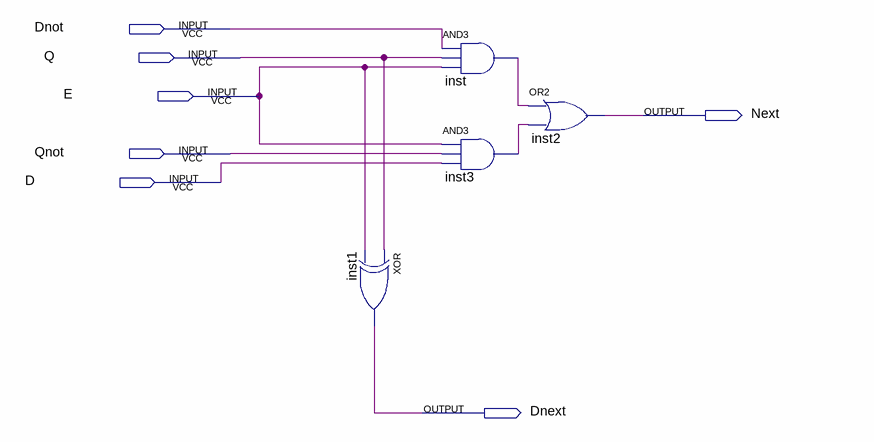
[diagram p0: schematic sheet]
// Quartus schematic block1.bdf as structural Verilog: 4 symbols, 7 pins
module block1 (
  input  Dnot,
  input  Q,
  input  E,
  input  Qnot,
  input  D,
  output Next,
  output Dnext
);

  wire inst3_out, inst_out;

  xor inst1 (Dnext, Q, E);
  and inst (inst_out, Dnot, Q, E);
  and inst3 (inst3_out, E, Qnot, D);
  or inst2 (Next, inst_out, inst3_out);
endmodule
